# EasyEDA schematic 1-Schematic_Task 10.1HD.json
TITLE: Task 10.1HD; REV: 1.0; Date: 2020-05-15; Sheet: 1/1; Drawn By: nmanoglou; Company: Your Company
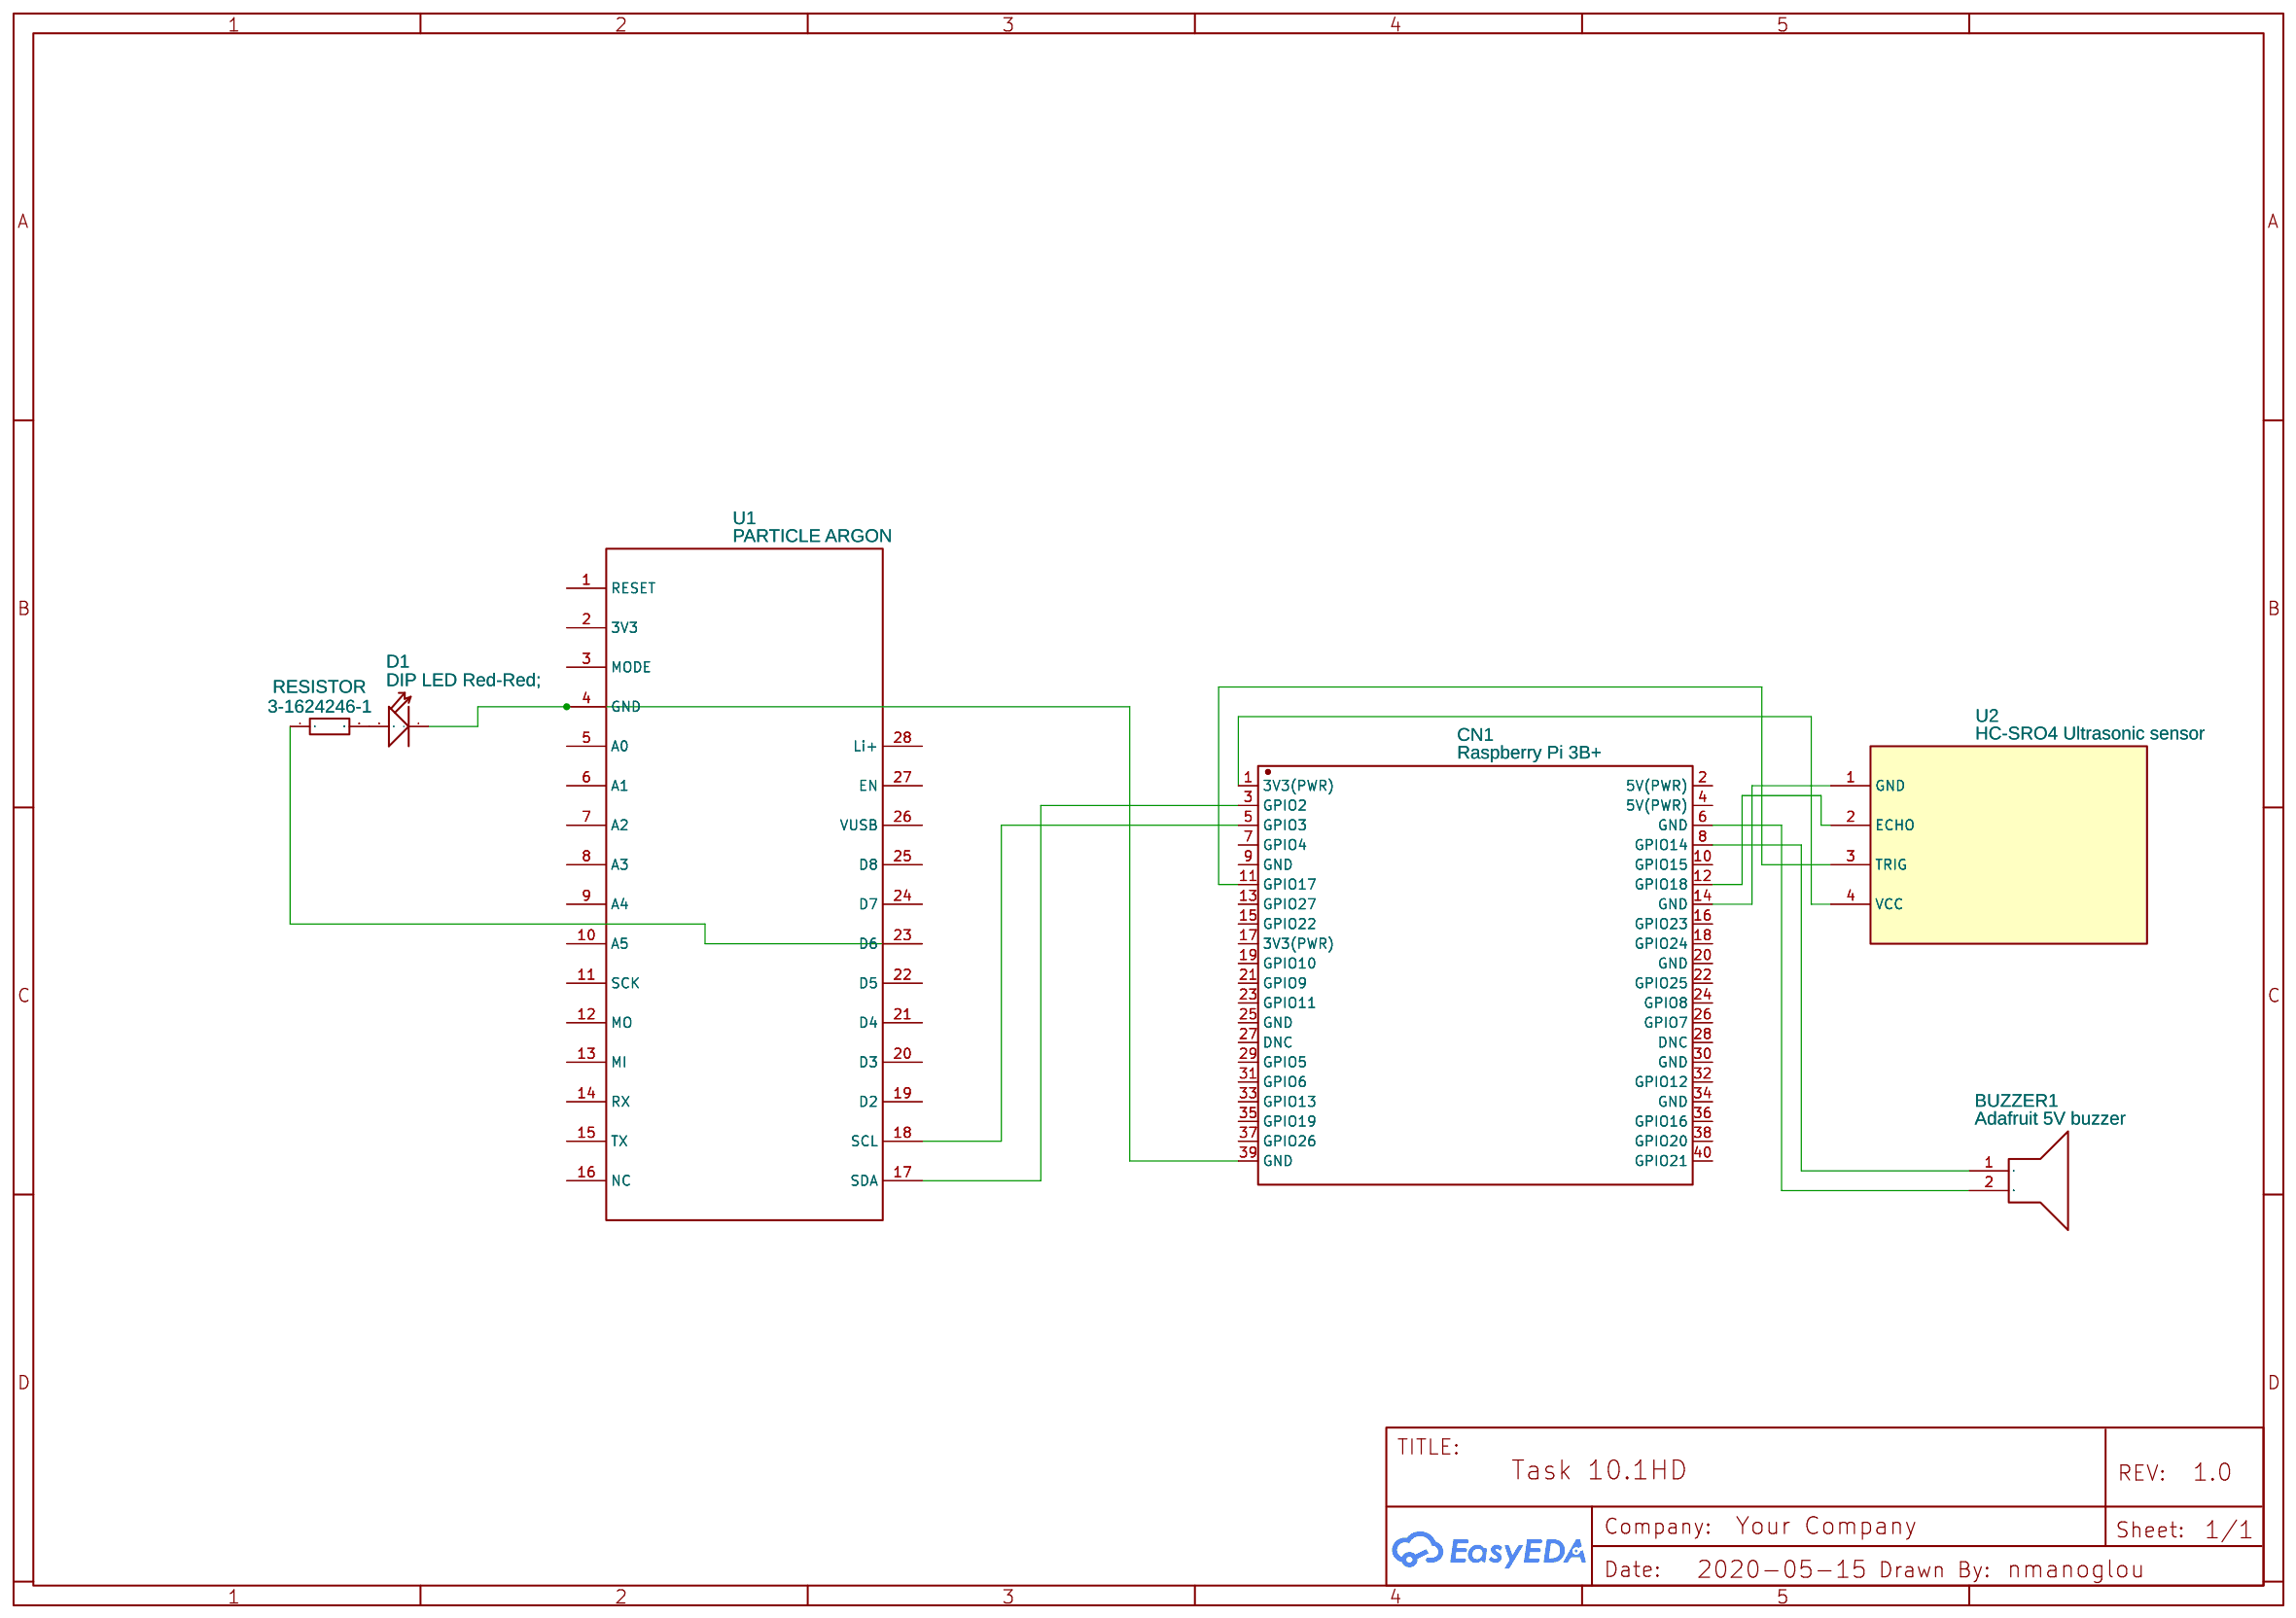
[diagram p0: schematic sheet]

## Parts
BUZZER1  Adafruit 5V buzzer  [BUZ-TH_BD12.0-P6.50-D0.8]
CN1  Raspberry Pi 3B+  [HDR2X20-REVERSED]
D1  DIP LED Red-Red;  [LED2-2.54-D3.0MM]
RESISTOR  3-1624246-1  [RES-TH_BD4.5-L11.0-P15.00-D0.8]
U1  PARTICLE ARGON  [PARTICLE_XENON]
U2  HC-SRO4 Ultrasonic sensor  [38 KHZ MODULATED IR SENSOR]

## Library data of the parts
BUZZER1 = GMC12085YA-16R2048: Supplier: LCSC; Supplier Part: C252920; Manufacturer: INGHAi; Contributor: LCSC
CN1 = Raspberry Pi 2: Contributor: Jason+Pierce; sourceId: gQK2WevN5
D1 = DIP LED Red-Red;: Manufacturer Part: ?
RESISTOR = 3-1624246-1: Supplier: LCSC; Supplier Part: C306238; Manufacturer: TE Connectivity; Resistance (Ohms): 39; Contributor: LCSC
U1 = PARTICLE ARGON: Contributor: farm21
U2 = 38 kHz modulated IR sensor: Contributor: winter2015; sourceId: YsmgyP7pj

## Nets
Net-(BUZZER1-1): BUZZER1.1 CN1.8(GPIO14)
Net-(BUZZER1-2): BUZZER1.2 CN1.6(GND)
Net-(CN1-1): CN1.1(3V3(PWR)) U2.4(VCC)
Net-(CN1-3): CN1.3(GPIO2) U1.17(SDA)
Net-(CN1-5): CN1.5(GPIO3) U1.18(SCL)
Net-(CN1-11): CN1.11(GPIO17) U2.3(TRIG)
Net-(CN1-12): CN1.12(GPIO18) U2.2(ECHO)
Net-(CN1-14): CN1.14(GND) U2.1(GND)
Net-(CN1-39): CN1.39(GND) D1.K(-) U1.4(GND)
Net-(D1-A): D1.A(+) RESISTOR.2
Net-(RESISTOR-1): RESISTOR.1 U1.23(D6)

Not connected (* = marked no-connect by the designer): CN1 2(5V(PWR)) 4(5V(PWR)) 7(GPIO4) 9(GND) 10(GPIO15) 13(GPIO27) 15(GPIO22) 16(GPIO23) 17(3V3(PWR)) 18(GPIO24) 19(GPIO10) 20(GND) 21(GPIO9) 22(GPIO25) 23(GPIO11) 24(GPIO8) 25(GND) 26(GPIO7) 27(DNC) 28(DNC) 29(GPIO5) 30(GND) 31(GPIO6) 32(GPIO12) 33(GPIO13) 34(GND) 35(GPIO19) 36(GPIO16) 37(GPIO26) 38(GPIO20) 40(GPIO21); U1 1(RESET) 2(3V3) 3(MODE) 5(A0) 6(A1) 7(A2) 8(A3) 9(A4) 10(A5) 11(SCK) 12(MO) 13(MI) 14(RX) 15(TX) 16(NC) 19(D2) 20(D3) 21(D4) 22(D5) 24(D7) 25(D8) 26(VUSB) 27(EN) 28(Li+)
